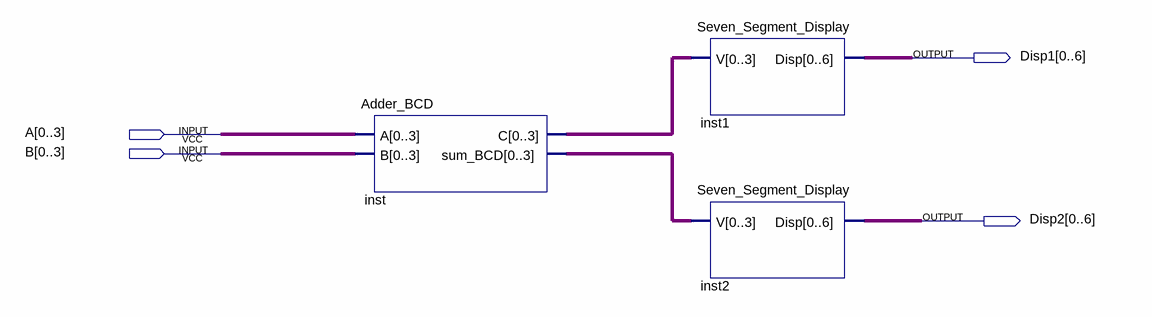
[diagram p0: schematic sheet]
// Quartus schematic BCD_Display.bdf as structural Verilog: 3 symbols, 4 pins
module BCD_Display (
  input  [0:3] A,
  input  [0:3] B,
  output [0:6] Disp1,
  output [0:6] Disp2
);

  wire [3:0] inst_c, inst_sum_bcd;

  Adder_BCD inst (.A(A), .B(B), .C(inst_c), .sum_BCD(inst_sum_bcd));
  Seven_Segment_Display inst1 (.V(inst_c), .Disp(Disp1));
  Seven_Segment_Display inst2 (.V(inst_sum_bcd), .Disp(Disp2));
endmodule
